# EAGLE schematic kramer-mc (EAGLE 9.5.0)

## Sheet 1 of 5: CPU-Karte
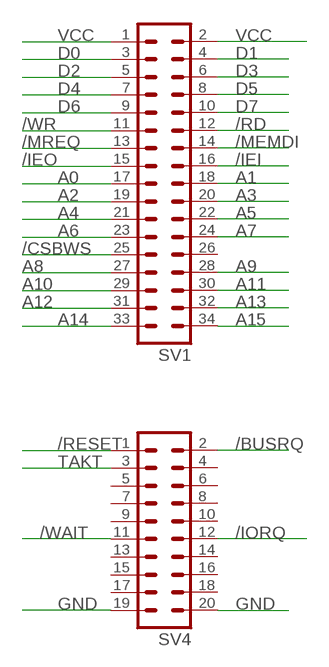
[diagram p0: schematic, sheet 1, part 1 of 2]
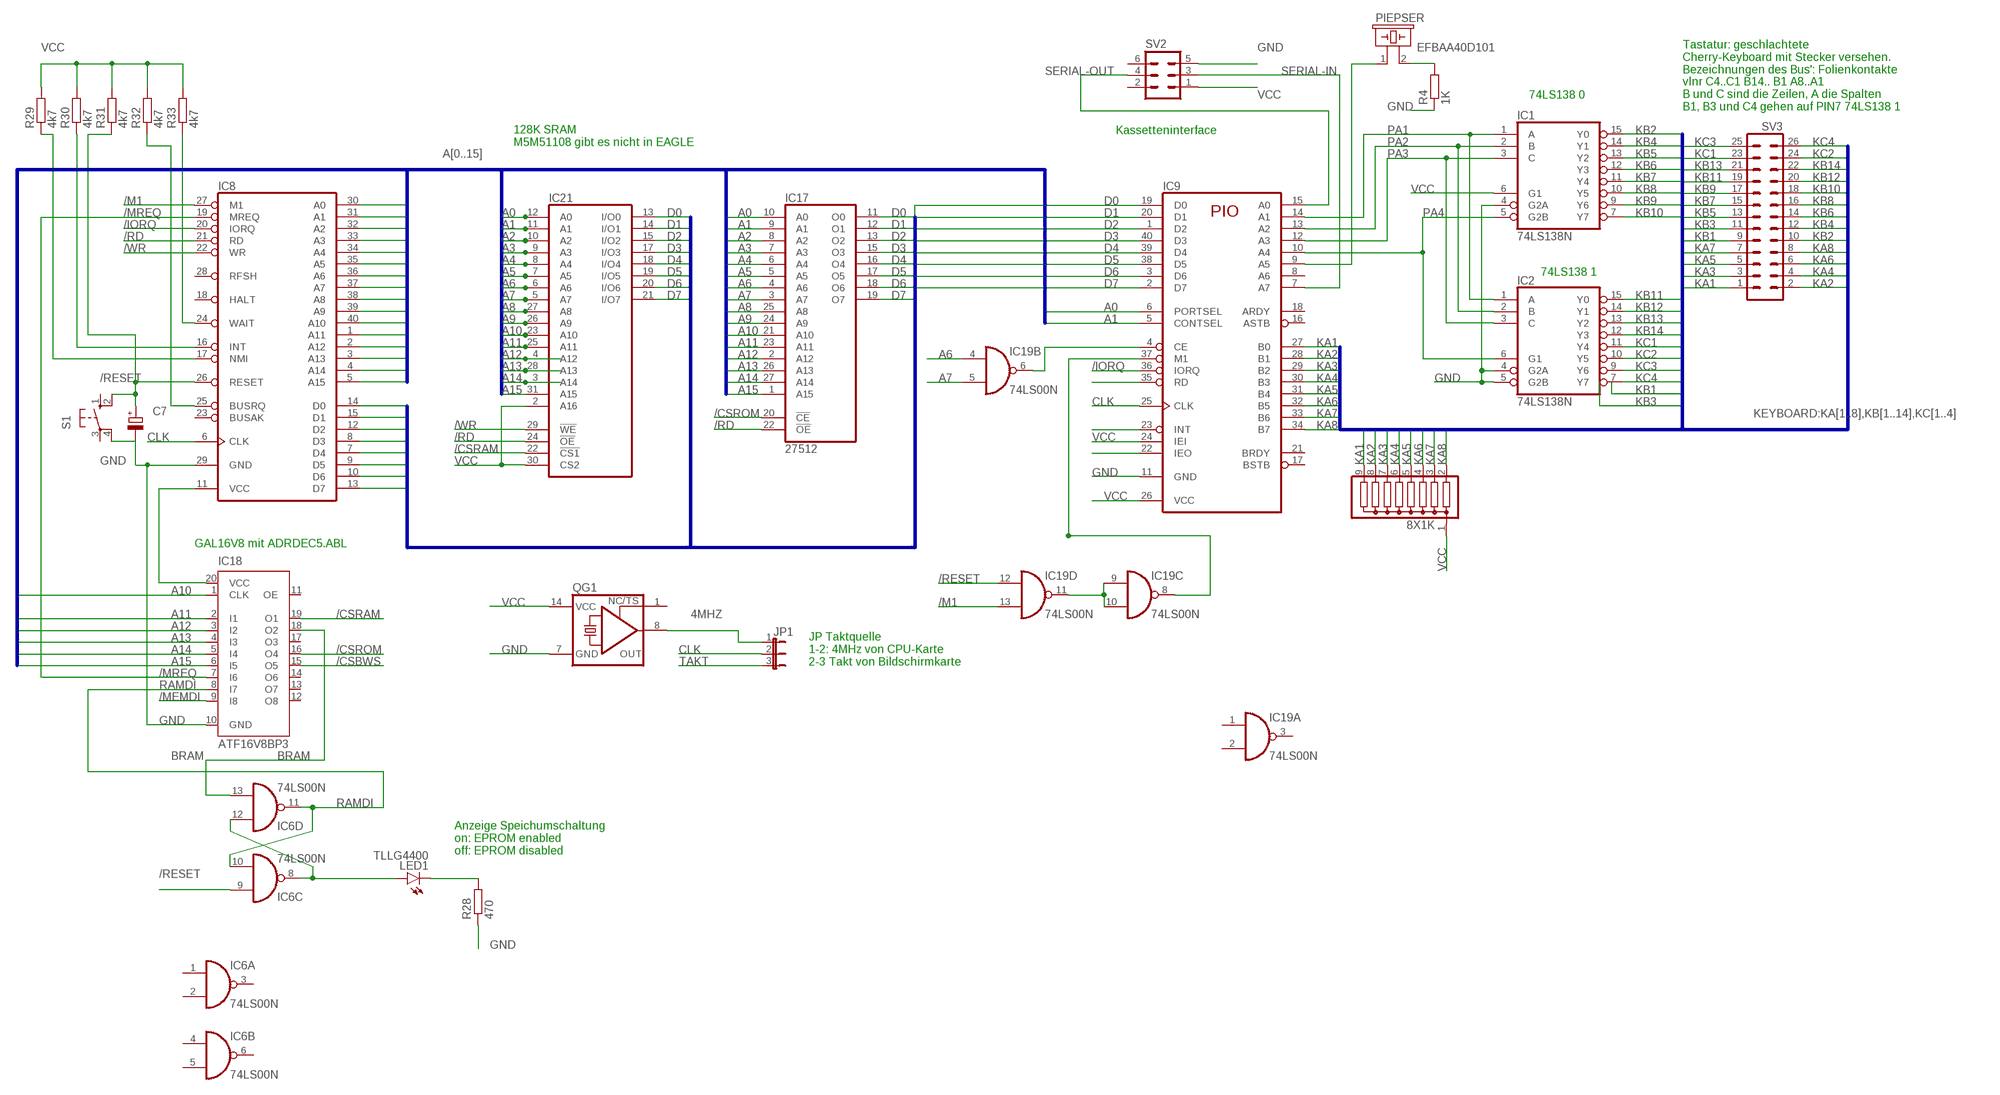
[diagram p1: schematic, sheet 1, part 2 of 2]

### Parts
8X1K  G08R  [SIL9]
C7  CPOL-EUE2-5  [E2-5]
IC1  74LS138N  [DIL16]
IC2  74LS138N  [DIL16]
IC6  74LS00N  [DIL14]
IC8  Z80CPU  [DIL40]
IC9  Z80PIO  [DIL40]
IC17  27512  [DIL28]
IC18  ATF16V8BP3  [DIL20]
IC19  74LS00N  [DIL14]
IC21  LP621024CM  [SOP32L]
JP1  JP2E  [JP2]
LED1  TLLG4400  [LED3MM]
PIEPSER  EFBAA40D101  [EFBAA40D101]
QG1  XO-14  [DIL14S]
R4  1K  R-EU_0207/10  [0207/10]
R28  470  R-EU_0207/10  [0207/10]
R29  4k7  R-EU_0207/10  [0207/10]
R30  4k7  R-EU_0207/10  [0207/10]
R31  4k7  R-EU_0207/10  [0207/10]
R32  4k7  R-EU_0207/10  [0207/10]
R33  4k7  R-EU_0207/10  [0207/10]
S1  10-XX  [B3F-10XX]
SV1  ML34  [ML34]
SV2  ML6  [ML6]
SV3  ML26L  [ML26L]
SV4  ML20  [ML20]

### Nets
4MHZ: JP1.1 QG1.8(OUT)
/BUSRQ: SV4.2 ; also sheet 2,4,5
/CSBWS: IC18.15(O5) SV1.25 ; also sheet 2,4
/CSRAM: IC18.19(O1) IC21.22(!CS1)
/CSROM: IC17.20(!CE) IC18.16(O4)
/IEI: SV1.16 ; also sheet 2,4,5
/IEO: SV1.15 ; also sheet 2,4,5
/IORQ: IC8.20(IORQ) IC9.36(IORQ) SV4.12 ; also sheet 2,4,5
/M1: IC8.27(M1) IC19.13(D:I1) ; also sheet 4,5
/MEMDI: IC18.9(I8) SV1.14 ; also sheet 2,4,5
/MREQ: IC8.19(MREQ) IC18.7(I6) SV1.13 ; also sheet 2,4,5
/RD: IC8.21(RD) IC17.22(!OE) IC21.24(!OE) SV1.12 ; also sheet 2,4,5
/RESET: C7.+ IC6.9(C:I0) IC8.26(RESET) IC19.12(D:I0) R31.1 S1.2(S1) SV4.1 ; also sheet 2,4
/WAIT: SV4.11 ; also sheet 2,4,5
/WR: IC8.22(WR) IC21.29(!WE) SV1.11 ; also sheet 2,4,5
A0: IC8.30(A0) IC9.6(PORTSEL) IC17.10(A0) IC21.12(A0) SV1.17 ; also sheet 2,4,5
A1: IC8.31(A1) IC9.5(CONTSEL) IC17.9(A1) IC21.11(A1) SV1.18 ; also sheet 2,4,5
A2: IC8.32(A2) IC17.8(A2) IC21.10(A2) SV1.19 ; also sheet 2,4,5
A3: IC8.33(A3) IC17.7(A3) IC21.9(A3) SV1.20 ; also sheet 2,4,5
A4: IC8.34(A4) IC17.6(A4) IC21.8(A4) SV1.21 ; also sheet 2,4,5
A5: IC8.35(A5) IC17.5(A5) IC21.7(A5) SV1.22 ; also sheet 2,4,5
A6: IC8.36(A6) IC17.4(A6) IC19.4(B:I0) IC21.6(A6) SV1.23 ; also sheet 2,4,5
A7: IC8.37(A7) IC17.3(A7) IC19.5(B:I1) IC21.5(A7) SV1.24 ; also sheet 2,4,5
A8: IC8.38(A8) IC17.25(A8) IC21.27(A8) SV1.27 ; also sheet 2,4,5
A9: IC8.39(A9) IC17.24(A9) IC21.26(A9) SV1.28 ; also sheet 2,4,5
A10: IC8.40(A10) IC17.21(A10) IC18.1(CLK) IC21.23(A10) SV1.29 ; also sheet 2,4,5
A11: IC8.1(A11) IC17.23(A11) IC18.2(I1) IC21.25(A11) SV1.30 ; also sheet 2,4,5
A12: IC8.2(A12) IC17.2(A12) IC18.3(I2) IC21.4(A12) SV1.31 ; also sheet 2,4,5
A13: IC8.3(A13) IC17.26(A13) IC18.4(I3) IC21.28(A13) SV1.32 ; also sheet 2,4,5
A14: IC8.4(A14) IC17.27(A14) IC18.5(I4) IC21.3(A14) SV1.33 ; also sheet 2,4,5
A15: IC8.5(A15) IC17.1(A15) IC18.6(I5) IC21.31(A15) SV1.34 ; also sheet 2,4,5
BRAM: IC6.13(D:I1) IC18.18(O2)
CLK: IC8.6(CLK) IC9.25(CLK) JP1.2
D0: IC8.14(D0) IC9.19(D0) IC17.11(O0) IC21.13(I/O0) SV1.3 ; also sheet 2,4,5
D1: IC8.15(D1) IC9.20(D1) IC17.12(O1) IC21.14(I/O1) SV1.4 ; also sheet 2,4,5
D2: IC8.12(D2) IC9.1(D2) IC17.13(O2) IC21.15(I/O2) SV1.5 ; also sheet 2,4,5
D3: IC8.8(D3) IC9.40(D3) IC17.15(O3) IC21.17(I/O3) SV1.6 ; also sheet 2,4,5
D4: IC8.7(D4) IC9.39(D4) IC17.16(O4) IC21.18(I/O4) SV1.7 ; also sheet 2,4,5
D5: IC8.9(D5) IC9.38(D5) IC17.17(O5) IC21.19(I/O5) SV1.8 ; also sheet 2,4,5
D6: IC8.10(D6) IC9.3(D6) IC17.18(O6) IC21.20(I/O6) SV1.9 ; also sheet 2,4,5
D7: IC8.13(D7) IC9.2(D7) IC17.19(O7) IC21.21(I/O7) SV1.10 ; also sheet 2,4,5
GND: C7.- IC1.4(G2A) IC2.4(G2A) IC2.5(G2B) IC8.29(GND) IC9.11(GND) IC18.10(GND) QG1.7(GND) R4.1 R28.1 S1.4(P1) SV2.5 SV4.19 SV4.20 ; also sheet 2,3,4,5
KA1: 8X1K.9 IC9.27(B0) SV3.1
KA2: 8X1K.8 IC9.28(B1) SV3.2
KA3: 8X1K.7 IC9.29(B2) SV3.3
KA4: 8X1K.6 IC9.30(B3) SV3.4
KA5: 8X1K.5 IC9.31(B4) SV3.5
KA6: 8X1K.4 IC9.32(B5) SV3.6
KA7: 8X1K.3 IC9.33(B6) SV3.7
KA8: 8X1K.2 IC9.34(B7) SV3.8
KB1: SV3.9
KB2: IC1.15(Y0) SV3.10
KB3: SV3.11
KB4: IC1.14(Y1) SV3.12
KB5: IC1.13(Y2) SV3.13
KB6: IC1.12(Y3) SV3.14
KB7: IC1.11(Y4) SV3.15
KB8: IC1.10(Y5) SV3.16
KB9: IC1.9(Y6) SV3.17
KB10: IC1.7(Y7) SV3.18
KB11: IC2.15(Y0) SV3.19
KB12: IC2.14(Y1) SV3.20
KB13: IC2.13(Y2) SV3.21
KB14: IC2.12(Y3) SV3.22
KC1: IC2.11(Y4) SV3.23
KC2: IC2.10(Y5) SV3.24
KC3: IC2.9(Y6) SV3.25
KC4: IC2.7(Y7) SV3.26
N$13: IC19.9(C:I0) IC19.10(C:I1) IC19.11(D:O)
N$16: IC8.11(VCC) IC18.20(VCC)
N$25: IC6.8(C:O) IC6.12(D:I0) LED1.A
N$27: LED1.K(C) R28.2
N$28: IC9.9(A5) PIEPSER.1
N$29: PIEPSER.2 R4.2
N$35: IC9.4(CE) IC19.6(B:O)
N$36: IC9.37(M1) IC19.8(C:O)
N$38: IC9.35(RD)
N$39: IC9.23(INT)
N$41: IC9.22(IEO)
N$42: IC8.17(NMI) R29.1
N$85: IC8.16(INT) R30.1
N$86: IC8.24(WAIT) R33.1
N$87: IC8.25(BUSRQ) R32.1
PA1: IC1.1(A) IC2.1(A) IC9.14(A1)
PA2: IC1.2(B) IC2.2(B) IC9.13(A2)
PA3: IC1.3(C) IC2.3(C) IC9.12(A3)
PA4: IC1.5(G2B) IC2.6(G1) IC9.10(A4)
RAMDI: IC6.10(C:I1) IC6.11(D:O) IC18.8(I7)
SERIAL-IN: IC9.7(A7) SV2.3
SERIAL-OUT: IC9.15(A0) SV2.4
TAKT: JP1.3 SV4.3 ; also sheet 2,4,5
VCC: 8X1K.1 IC1.6(G1) IC9.24(IEI) IC9.26(VCC) IC21.2(A16) IC21.30(CS2) QG1.14(VCC) R29.2 R30.2 R31.2 R32.2 R33.2 SV1.1 SV1.2 SV2.1 ; also sheet 2,3,4,5
Unconnected: IC6.1(A:I0) IC6.2(A:I1) IC6.3(A:O) IC6.4(B:I0) IC6.5(B:I1) IC6.6(B:O) IC8.18(HALT) IC8.23(BUSAK) IC8.28(RFSH) IC9.8(A6) IC9.16(ASTB) IC9.17(BSTB) IC9.18(ARDY) IC9.21(BRDY) IC18.11(OE) IC18.12(O8) IC18.13(O7) IC18.14(O6) IC18.17(O3) IC19.1(A:I0) IC19.2(A:I1) IC19.3(A:O) IC21.1(NC) QG1.1(TS) S1.1(S) S1.3(P) SV1.26 SV2.2 SV2.6 SV4.4 SV4.5 SV4.6 SV4.7 SV4.8 SV4.9 SV4.10 SV4.13 SV4.14 SV4.15 SV4.16 SV4.17 SV4.18

### Buses
D[0..7]
A[0..15]
KEYBOARD:KA[1..8],KB[1..14],KC[1..4]

### Notes on the sheet
- 74LS138 0
- Tastatur: geschlachtete 
  Cherry-Keyboard mit Stecker versehen.
  Bezeichnungen des Bus': Folienkontakte
  vlnr C4..C1 B14.. B1 A8..A1
  B und C sind die Zeilen, A die Spalten
  B1, B3 und C4 gehen auf PIN7 74LS138 1
- Kassetteninterface
- 128K SRAM
  M5M51108 gibt es nicht in EAGLE
- 74LS138 1
- GAL16V8 mit ADRDEC5.ABL
- JP Taktquelle
  1-2: 4MHz von CPU-Karte
  2-3 Takt von Bildschirmkarte
- Anzeige Speichumschaltung
  on: EPROM enabled
  off: EPROM disabled

## Sheet 2 of 5: Bildschirmkarte
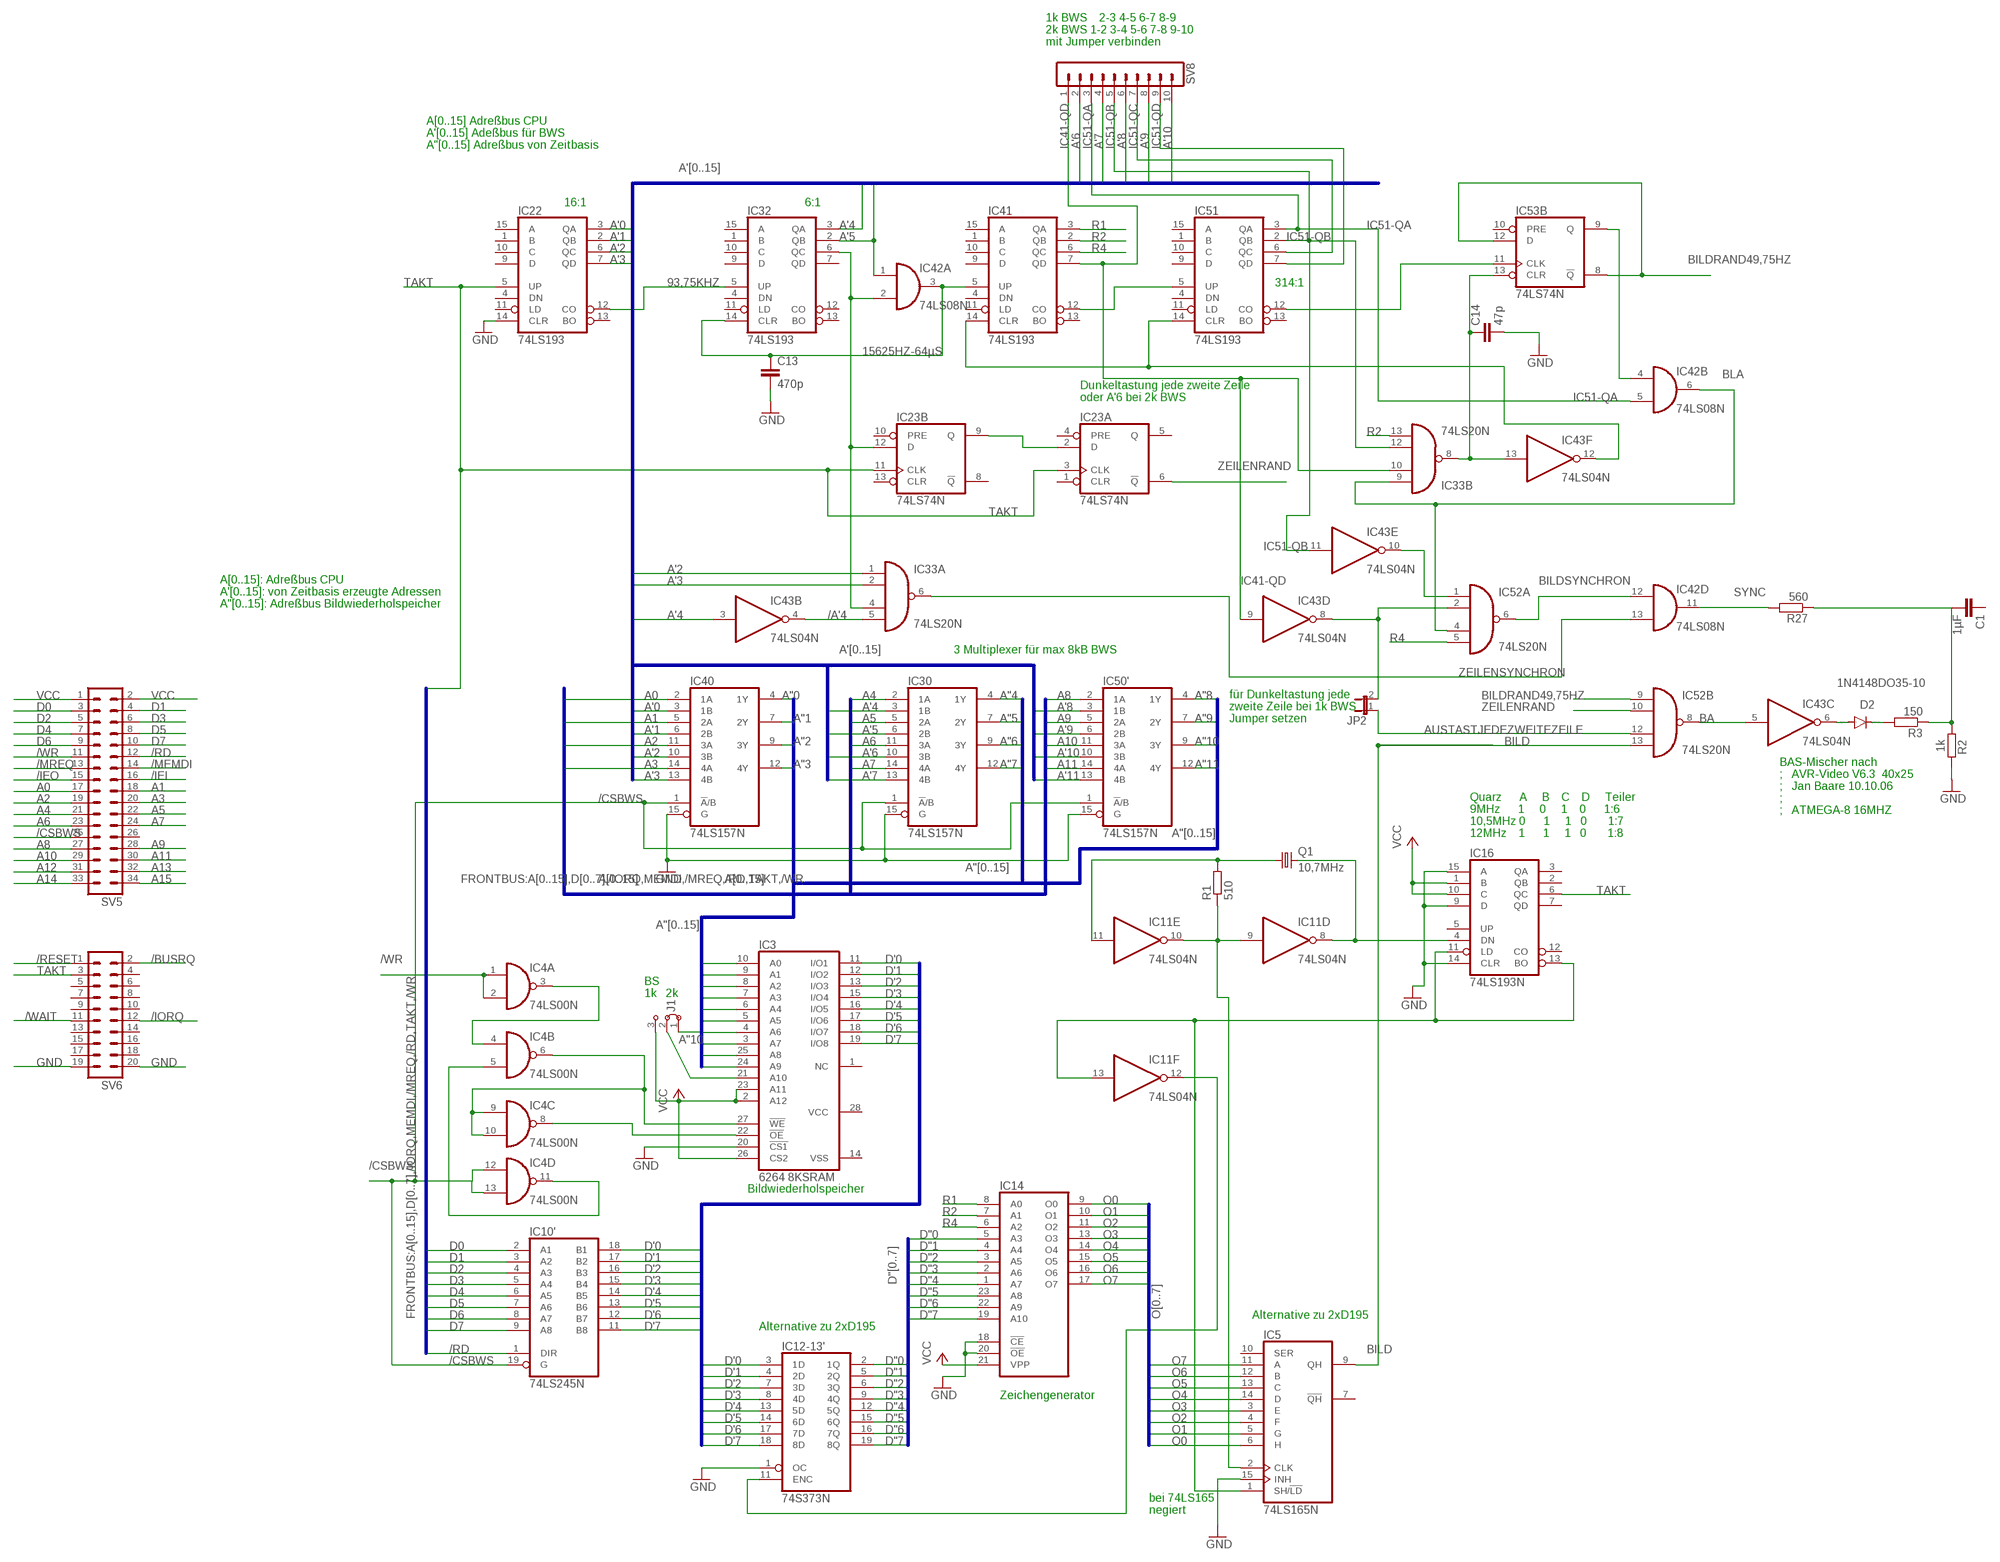
[diagram p2: schematic, sheet 2]

### Parts
C1  1µF  C-EU050-025X075  [C050-025X075]
C13  470p  C-EU050-024X044  [C050-024X044]
C14  47p  C-EU050-024X044  [C050-024X044]
D2  1N4148DO35-10  [DO35-10]
IC3  6264 8KSRAM  6264A  [DIL28-6]
IC4  74LS00N  [DIL14]
IC5  74LS165N  [DIL16]
IC10'  74LS245N  [DIL20]
IC11  74LS04N  [DIL14]
IC12-13'  74S373N  [DIL20]
IC14  2716  [DIL24]
IC16  74LS193N  74LS192N  [DIL16]
IC22  74LS193  74LS192N  [DIL16]
IC23  74LS74N  [DIL14]
IC30  74LS157N  [DIL16]
IC32  74LS193  74LS192N  [DIL16]
IC33  74LS20N  [DIL14]
IC40  74LS157N  [DIL16]
IC41  74LS193  74LS192N  [DIL16]
IC42  74LS08N  [DIL14]
IC43  74LS04N  [DIL14]
IC50'  74LS157N  [DIL16]
IC51  74LS193  74LS192N  [DIL16]
IC52  74LS20N  [DIL14]
IC53  74LS74N  [DIL14]
J1  J2X2MM  [04C]
JP2  JP1E  [JP1]
Q1  10,7MHz  CRYSTALHC49U-V  [HC49U-V]
R1  510  R-EU_0309/12  [0309/12]
R2  1k  R-EU_0309/12  [0309/12]
R3  150  R-EU_0309/12  [0309/12]
R27  560  R-EU_0309/12  [0309/12]
SV5  ML34  [ML34]
SV6  ML20  [ML20]
SV8  MA10-1  [MA10-1]

### Nets
93,75KHZ: IC22.12(CO) IC32.5(UP)
15625HZ-64µS: C13.1 IC32.14(CLR) IC41.5(UP) IC42.3(A:O)
/A'4: IC33.5(A:I3) IC43.4(B:O)
/BUSRQ: SV6.2 ; also sheet 1,4,5
/CSBWS: IC4.12(D:I0) IC4.13(D:I1) IC10'.19(G) IC30.1(!A!/B) IC40.1(!A!/B) IC50'.1(!A!/B) SV5.25 ; also sheet 1,4
/IEI: SV5.16 ; also sheet 1,4,5
/IEO: SV5.15 ; also sheet 1,4,5
/IORQ: SV6.12 ; also sheet 1,4,5
/MEMDI: SV5.14 ; also sheet 1,4,5
/MREQ: SV5.13 ; also sheet 1,4,5
/RD: IC10'.1(DIR) SV5.12 ; also sheet 1,4,5
/RESET: SV6.1 ; also sheet 1,4
/WAIT: SV6.11 ; also sheet 1,4,5
/WR: IC4.1(A:I0) IC4.2(A:I1) SV5.11 ; also sheet 1,4,5
A0: IC40.2(1A) SV5.17 ; also sheet 1,4,5
A1: IC40.5(2A) SV5.18 ; also sheet 1,4,5
A2: IC40.11(3A) SV5.19 ; also sheet 1,4,5
A3: IC40.14(4A) SV5.20 ; also sheet 1,4,5
A4: IC30.2(1A) SV5.21 ; also sheet 1,4,5
A5: IC30.5(2A) SV5.22 ; also sheet 1,4,5
A6: IC30.11(3A) SV5.23 ; also sheet 1,4,5
A7: IC30.14(4A) SV5.24 ; also sheet 1,4,5
A8: IC50'.2(1A) SV5.27 ; also sheet 1,4,5
A9: IC50'.5(2A) SV5.28 ; also sheet 1,4,5
A10: IC50'.11(3A) SV5.29 ; also sheet 1,4,5
A11: IC50'.14(4A) SV5.30 ; also sheet 1,4,5
A12: SV5.31 ; also sheet 1,4,5
A13: SV5.32 ; also sheet 1,4,5
A14: SV5.33 ; also sheet 1,4,5
A15: SV5.34 ; also sheet 1,4,5
A'0: IC22.3(QA) IC40.3(1B)
A'1: IC22.2(QB) IC40.6(2B)
A'2: IC22.6(QC) IC33.1(A:I0) IC40.10(3B)
A'3: IC22.7(QD) IC33.2(A:I1) IC40.13(4B)
A'4: IC30.3(1B) IC32.3(QA) IC43.3(B:I)
A'5: IC30.6(2B) IC32.2(QB) IC42.1(A:I0)
A'6: IC30.10(3B) SV8.2
A'7: IC30.13(4B) SV8.4
A'8: IC50'.3(1B) SV8.6
A'9: IC50'.6(2B) SV8.8
A'10: IC50'.10(3B) SV8.10
A'11: IC50'.13(4B)
A''0: IC3.10(A0) IC40.4(1Y)
A''1: IC3.9(A1) IC40.7(2Y)
A''2: IC3.8(A2) IC40.9(3Y)
A''3: IC3.7(A3) IC40.12(4Y)
A''4: IC3.6(A4) IC30.4(1Y)
A''5: IC3.5(A5) IC30.7(2Y)
A''6: IC3.4(A6) IC30.9(3Y)
A''7: IC3.3(A7) IC30.12(4Y)
A''8: IC3.25(A8) IC50'.4(1Y)
A''9: IC3.24(A9) IC50'.7(2Y)
A''10: IC50'.9(3Y) J1.1
A''11: IC50'.12(4Y)
AUSTASTJEDEZWEITEZEILE: IC52.12(B:I2) JP2.1
BA: IC43.5(C:I) IC52.8(B:O)
BILD: IC5.9(QH) IC52.13(B:I3)
BILDRAND49,75HZ: IC52.9(B:I0) IC53.8(B:!Q) IC53.12(B:D)
BILDSYNCHRON: IC42.12(D:I0) IC52.6(A:O)
BLA: IC33.9(B:I0) IC42.6(B:O) IC52.4(A:I2)
D0: IC10'.2(A1) SV5.3 ; also sheet 1,4,5
D1: IC10'.3(A2) SV5.4 ; also sheet 1,4,5
D2: IC10'.4(A3) SV5.5 ; also sheet 1,4,5
D3: IC10'.5(A4) SV5.6 ; also sheet 1,4,5
D4: IC10'.6(A5) SV5.7 ; also sheet 1,4,5
D5: IC10'.7(A6) SV5.8 ; also sheet 1,4,5
D6: IC10'.8(A7) SV5.9 ; also sheet 1,4,5
D7: IC10'.9(A8) SV5.10 ; also sheet 1,4,5
D'0: IC3.11(I/O1) IC10'.18(B1) IC12-13'.3(1D)
D'1: IC3.12(I/O2) IC10'.17(B2) IC12-13'.4(2D)
D'2: IC3.13(I/O3) IC10'.16(B3) IC12-13'.7(3D)
D'3: IC3.15(I/O4) IC10'.15(B4) IC12-13'.8(4D)
D'4: IC3.16(I/O5) IC10'.14(B5) IC12-13'.13(5D)
D'5: IC3.17(I/O6) IC10'.13(B6) IC12-13'.14(6D)
D'6: IC3.18(I/O7) IC10'.12(B7) IC12-13'.17(7D)
D'7: IC3.19(I/O8) IC10'.11(B8) IC12-13'.18(8D)
D''0: IC12-13'.2(1Q) IC14.5(A3)
D''1: IC12-13'.5(2Q) IC14.4(A4)
D''2: IC12-13'.6(3Q) IC14.3(A5)
D''3: IC12-13'.9(4Q) IC14.2(A6)
D''4: IC12-13'.12(5Q) IC14.1(A7)
D''5: IC12-13'.15(6Q) IC14.23(A8)
D''6: IC12-13'.16(7Q) IC14.22(A9)
D''7: IC12-13'.19(8Q) IC14.19(A10)
GND: C13.2 C14.2 IC3.20(!CS1) IC5.15(INH) IC12-13'.1(OC) IC14.18(!CE) IC14.20(!OE) IC16.9(D) IC16.14(CLR) IC16.15(A) IC22.14(CLR) IC30.15(G) IC40.15(G) IC50'.15(G) R2.2 SV6.19 SV6.20 ; also sheet 1,3,4,5
IC41-QD: IC33.10(B:I1) IC41.7(QD) IC43.9(D:I) SV8.1
IC51-QA: IC42.5(B:I1) IC51.3(QA) SV8.3
IC51-QB: IC33.12(B:I2) IC43.11(E:I) IC51.2(QB) SV8.5
IC51-QC: IC51.6(QC) SV8.7
IC51-QD: IC51.7(QD) SV8.9
N$1: IC43.8(D:O) IC52.2(A:I1) JP2.2
N$2: IC41.12(CO) IC51.5(UP)
N$3: IC23.12(B:D) IC32.6(QC) IC33.4(A:I2) IC42.2(A:I1)
N$4: IC23.2(A:D) IC23.9(B:Q)
N$5: IC41.14(CLR) IC43.12(F:O) IC51.14(CLR)
N$6: IC51.12(CO) IC53.11(B:CLK)
N$7: IC3.21(A10) J1.2
N$8: IC42.4(B:I0) IC53.9(B:Q)
N$9: IC4.3(A:O) IC4.4(B:I0)
N$10: C14.1 IC33.8(B:O) IC43.13(F:I) IC53.13(B:CLR)
N$15: IC43.10(E:O) IC52.1(A:I0)
N$17: IC5.2(CLK) IC11.9(D:I) IC11.10(E:O) R1.1
N$18: IC11.12(F:O) IC12-13'.11(ENC)
N$19: D2.A IC43.6(C:O)
N$20: IC11.8(D:O) IC16.4(DN) Q1.2
N$21: IC11.11(E:I) Q1.1 R1.2
N$22: IC5.1(SH/!LD) IC11.13(F:I) IC16.11(LD) IC16.13(BO)
N$23: D2.C R3.2
N$24: C1.2 R2.1 R3.1 R27.1
N$40: IC4.5(B:I1) IC4.11(D:O)
N$83: IC3.22(!OE) IC4.8(C:O)
N$84: IC3.27(!WE) IC4.6(B:O) IC4.9(C:I0) IC4.10(C:I1)
O0: IC5.6(H) IC14.9(O0)
O1: IC5.5(G) IC14.10(O1)
O2: IC5.4(F) IC14.11(O2)
O3: IC5.3(E) IC14.13(O3)
O4: IC5.14(D) IC14.14(O4)
O5: IC5.13(C) IC14.15(O5)
O6: IC5.12(B) IC14.16(O6)
O7: IC5.11(A) IC14.17(O7)
R1: IC14.8(A0) IC41.3(QA)
R2: IC14.7(A1) IC33.13(B:I3) IC41.2(QB)
R4: IC14.6(A2) IC41.6(QC) IC52.5(A:I3)
SYNC: IC42.11(D:O) R27.2
TAKT: IC16.6(QC) IC22.5(UP) IC23.3(A:CLK) IC23.11(B:CLK) SV6.3 ; also sheet 1,4,5
VCC: IC3.2(A12) IC3.23(A11) IC3.26(CS2) IC14.21(VPP) IC16.1(B) IC16.10(C) J1.3 SV5.1 SV5.2 ; also sheet 1,3,4,5
ZEILENRAND: IC23.6(A:!Q) IC52.10(B:I1)
ZEILENSYNCHRON: IC33.6(A:O) IC42.13(D:I1)
Unconnected: C1.1 IC3.1(NC) IC5.7(!QH) IC5.10(SER) IC11.1(A:I) IC11.2(A:O) IC11.3(B:I) IC11.4(B:O) IC11.5(C:I) IC11.6(C:O) IC16.2(QB) IC16.3(QA) IC16.5(UP) IC16.7(QD) IC16.12(CO) IC22.1(B) IC22.4(DN) IC22.9(D) IC22.10(C) IC22.11(LD) IC22.13(BO) IC22.15(A) IC23.1(A:CLR) IC23.4(A:PRE) IC23.5(A:Q) IC23.8(B:!Q) IC23.10(B:PRE) IC23.13(B:CLR) IC32.1(B) IC32.4(DN) IC32.7(QD) IC32.9(D) IC32.10(C) IC32.11(LD) IC32.12(CO) IC32.13(BO) IC32.15(A) IC41.1(B) IC41.4(DN) IC41.9(D) IC41.10(C) IC41.11(LD) IC41.13(BO) IC41.15(A) IC42.8(C:O) IC42.9(C:I0) IC42.10(C:I1) IC43.1(A:I) IC43.2(A:O) IC51.1(B) IC51.4(DN) IC51.9(D) IC51.10(C) IC51.11(LD) IC51.13(BO) IC51.15(A) IC53.1(A:CLR) IC53.2(A:D) IC53.3(A:CLK) IC53.4(A:PRE) IC53.5(A:Q) IC53.6(A:!Q) IC53.10(B:PRE) SV5.26 SV6.4 SV6.5 SV6.6 SV6.7 SV6.8 SV6.9 SV6.10 SV6.13 SV6.14 SV6.15 SV6.16 SV6.17 SV6.18

### Buses
A[0..15]
A'[0..15]
D'[0..7]
O[0..7]
FRONTBUS:A[0..15],D[0..7],/IORQ,MEMDI,/MREQ,/RD,TAKT,/WR
A''[0..15]
D''[0..7]

### Notes on the sheet
- 1k BWS    2-3 4-5 6-7 8-9
  2k BWS 1-2 3-4 5-6 7-8 9-10
  mit Jumper verbinden
- A[0..15] Adreßbus CPU
  A'[0..15] Adeßbus für BWS
  A''[0..15] Adreßbus von Zeitbasis
- 16:1 | 6:1
- 314:1
- Dunkeltastung jede zweite Zeile
  oder A'6 bei 2k BWS
- A[0..15]: Adreßbus CPU
  A'[0..15]: von Zeitbasis erzeugte Adressen
  A''[0..15]: Adreßbus Bildwiederholspeicher
- 3 Multiplexer für max 8kB BWS
- für Dunkeltastung jede
  zweite Zeile bei 1k BWS 
  Jumper setzen
- BAS-Mischer nach
  ;   AVR-Video V6.3  40x25
  ;   Jan Baare 10.10.06
  ;
  ;   ATMEGA-8 16MHZ
- Quarz      A     B    C    D     Teiler
  9MHz      1     0     1    0      1:6
  10,5MHz 0      1     1   0       1:7
  12MHz    1      1     1   0       1:8
- BS
  1k   2k
- Bildwiederholspeicher
- Alternative zu 2xD195
- Alternative zu 2xD195
- Zeichengenerator
- bei 74LS165 
  negiert

## Sheet 3 of 5: Kassetteninterface
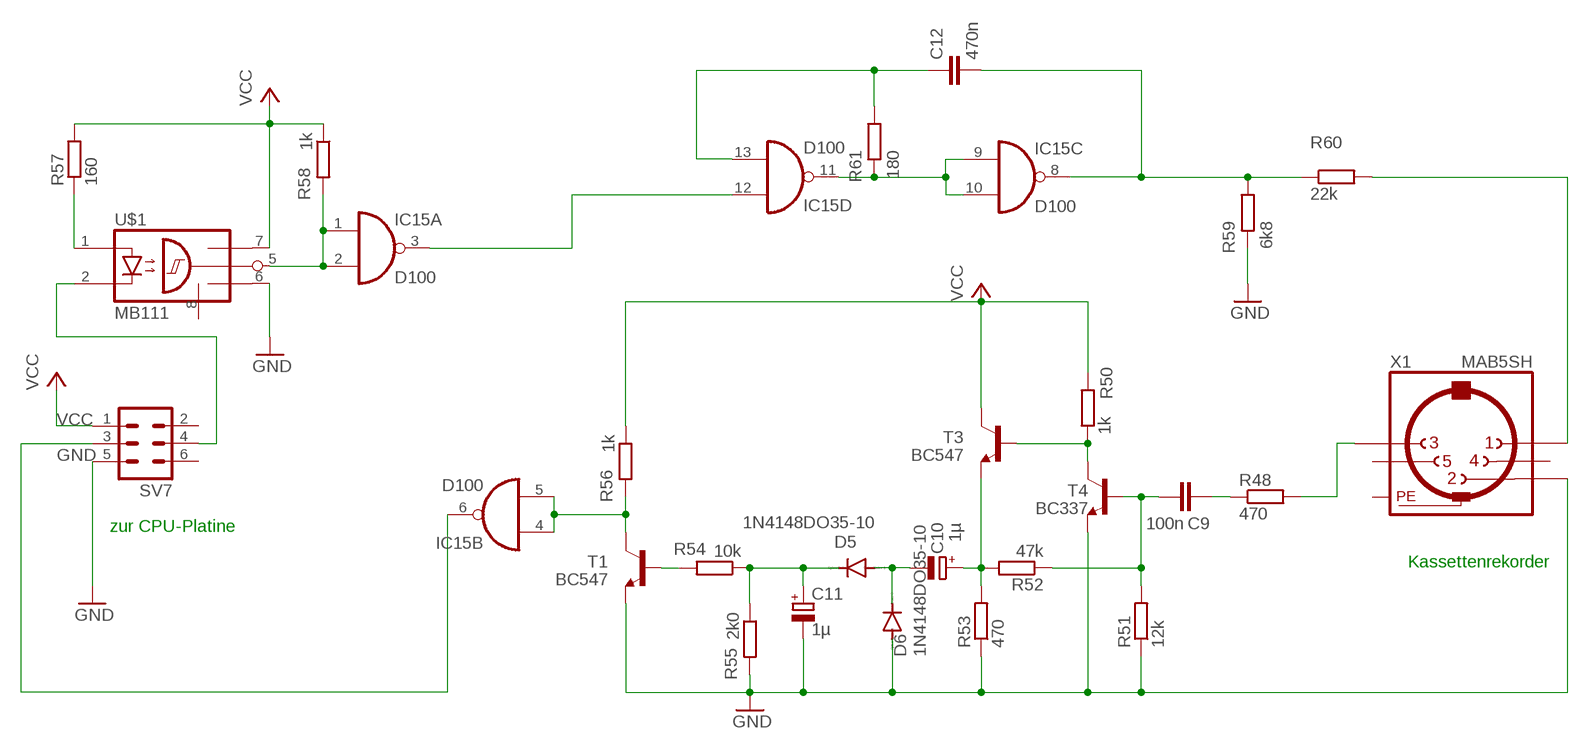
[diagram p3: schematic, sheet 3]

### Parts
C9  100n  C-EU025-025X050  [C025-025X050]
C10  1µ  CPOL-EUE2,5-6E  [E2,5-6E]
C11  1µ  CPOL-EUE2,5-6E  [E2,5-6E]
C12  470n  C-EU150-064X183  [C150-064X183]
D5  1N4148DO35-10  [DO35-10]
D6  1N4148DO35-10  [DO35-10]
IC15  D100  7400N  [DIL14]
R48  470  R-EU_0207/10  [0207/10]
R50  1k  R-EU_0207/10  [0207/10]
R51  12k  R-EU_0207/10  [0207/10]
R52  47k  R-EU_0207/10  [0207/10]
R53  470  R-EU_0207/10  [0207/10]
R54  10k  R-EU_0207/10  [0207/10]
R55  2k0  R-EU_0207/10  [0207/10]
R56  1k  R-EU_0207/10  [0207/10]
R57  160  R-EU_0207/10  [0207/10]
R58  1k  R-EU_0207/10  [0207/10]
R59  6k8  R-EU_0207/10  [0207/10]
R60  22k  R-EU_0207/10  [0207/10]
R61  180  R-EU_0207/10  [0207/10]
SV7  ML6  [ML6]
T1  BC547  [TO92]
T3  BC547  [TO92]
T4  BC337  [TO92]
U$1  MB111  [DIL8]
X1  MAB5SH  [MAB5SH]

### Nets
GND: C11.- D6.A R51.1 R53.1 R55.2 R59.2 SV7.5 T1.1(E) T4.1(E) U$1.6(GND1) X1.2 ; also sheet 1,2,4,5
N$88: IC15.6(B:O) SV7.3
N$89: SV7.4 U$1.2(C)
N$108: R48.2 X1.3
N$109: C9.1 R48.1
N$119: C9.2 R51.2 R52.1 T4.2(B)
N$120: R50.1 T3.2(B) T4.3(C)
N$121: R57.1 U$1.1(A)
N$122: C10.+ R52.2 R53.2 T3.1(E)
N$123: IC15.1(A:I0) IC15.2(A:I1) R58.2 U$1.5(OUT1)
N$124: C10.- D5.A D6.C
N$125: C11.+ D5.C R54.1 R55.1
N$126: R60.2 X1.1
N$127: R54.2 T1.2(B)
N$128: IC15.4(B:I0) IC15.5(B:I1) R56.2 T1.3(C)
N$129: IC15.9(C:I0) IC15.10(C:I1) IC15.11(D:O) R61.2
N$130: C12.1 IC15.13(D:I1) R61.1
N$131: C12.2 IC15.8(C:O) R59.1 R60.1
N$132: IC15.3(A:O) IC15.12(D:I0)
VCC: R50.2 R56.1 R57.2 R58.1 SV7.1 T3.3(C) U$1.7(VCC1) ; also sheet 1,2,4,5
Unconnected: SV7.2 SV7.6 U$1.8(KATHODE_EMPF) X1.4 X1.5

### Notes on the sheet
- zur CPU-Platine
- Kassettenrekorder

## Sheet 4 of 5: FDC-Karte
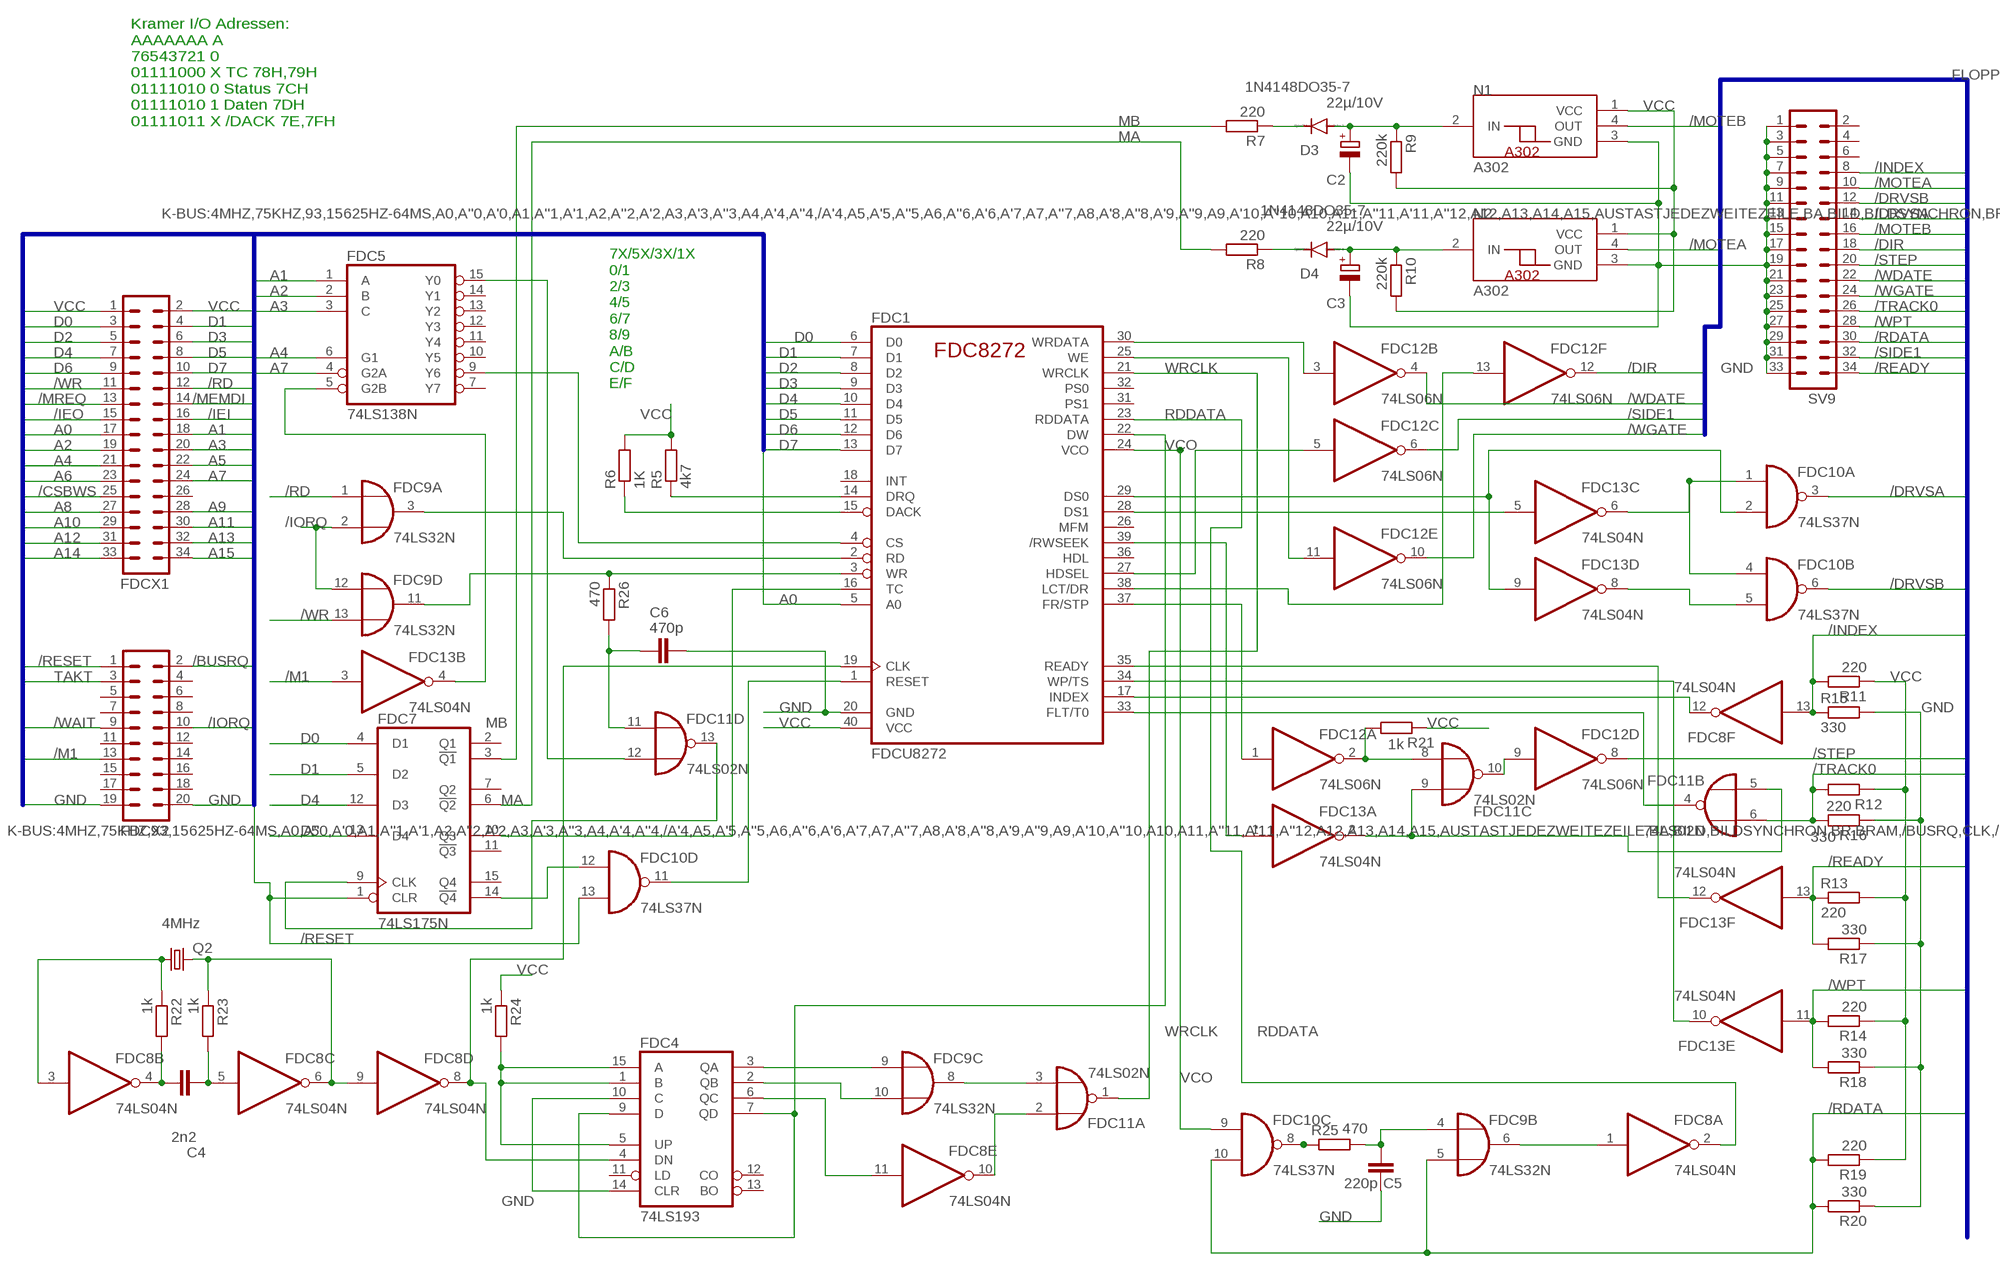
[diagram p4: schematic, sheet 4, part 1 of 2]
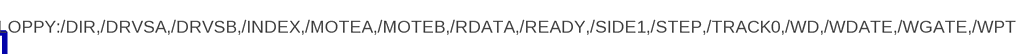
[diagram p5: schematic, sheet 4, part 2 of 2]

### Parts
C2  22µ/10V  CPOL-EUE2.5-5  [E2,5-5]
C3  22µ/10V  CPOL-EUE2.5-5  [E2,5-5]
C4  2n2  C-EU025-025X050  [C025-025X050]
C5  220p  C-EU025-025X050  [C025-025X050]
C6  470p  C-EU025-025X050  [C025-025X050]
D3  1N4148DO35-7  [DO35-7]
D4  1N4148DO35-7  [DO35-7]
FDC1  FDCU8272  [DIL40]
FDC4  74LS193  74HC192N  [DIL16]
FDC5  74LS138N  [DIL16]
FDC7  74LS175N  [DIL16]
FDC8  74LS04N  [DIL14]
FDC9  74LS32N  [DIL14]
FDC10  74LS37N  [DIL14]
FDC11  74LS02N  [DIL14]
FDC12  74LS06N  [DIL14]
FDC13  74LS04N  [DIL14]
FDCX1  ML34  [ML34]
FDCX2  ML20  [ML20]
N1  A302  [DIL04]
N2  A302  [DIL04]
Q2  4MHz  CRYSTALHC49U-V  [HC49U-V]
R5  4k7  R-EU_0207/10  [0207/10]
R6  1K  R-EU_0207/10  [0207/10]
R7  220  R-EU_0207/10  [0207/10]
R8  220  R-EU_0207/10  [0207/10]
R9  220k  R-EU_0207/10  [0207/10]
R10  220k  R-EU_0207/10  [0207/10]
R11  220  R-EU_0207/10  [0207/10]
R12  220  R-EU_0207/10  [0207/10]
R13  220  R-EU_0207/10  [0207/10]
R14  220  R-EU_0207/10  [0207/10]
R15  330  R-EU_0207/10  [0207/10]
R16  330  R-EU_0207/10  [0207/10]
R17  330  R-EU_0207/10  [0207/10]
R18  330  R-EU_0207/10  [0207/10]
R19  220  R-EU_0207/10  [0207/10]
R20  330  R-EU_0207/10  [0207/10]
R21  1k  R-EU_0207/10  [0207/10]
R22  1k  R-EU_0207/10  [0207/10]
R23  1k  R-EU_0207/10  [0207/10]
R24  1k  R-EU_0207/10  [0207/10]
R25  470  R-EU_0207/10  [0207/10]
R26  470  R-EU_0207/10  [0207/10]
SV9  ML34  [ML34]

### Nets
/BUSRQ: FDCX2.2 ; also sheet 1,2,5
/CSBWS: FDCX1.25 ; also sheet 1,2
/DIR: FDC12.12(F:O) SV9.18
/DRVSA: FDC10.3(A:O) SV9.14
/DRVSB: FDC10.6(B:O) SV9.12
/IEI: FDCX1.16 ; also sheet 1,2,5
/IEO: FDCX1.15 ; also sheet 1,2,5
/INDEX: FDC8.13(F:I) R11.2 R15.1 SV9.8
/IORQ: FDC9.2(A:I1) FDC9.12(D:I0) FDCX2.10 ; also sheet 1,2,5
/M1: FDC13.3(B:I) FDCX2.13 ; also sheet 1,5
/MEMDI: FDCX1.14 ; also sheet 1,2,5
/MOTEA: N2.4(OUT) SV9.10
/MOTEB: N1.4(OUT) SV9.16
/MREQ: FDCX1.13 ; also sheet 1,2,5
/RD: FDC9.1(A:I0) FDCX1.12 ; also sheet 1,2,5
/RDATA: FDC9.5(B:I1) FDC10.10(C:I1) R19.2 R20.2 SV9.30
/READY: FDC13.13(F:I) R13.1 R17.2 SV9.34
/RESET: FDC7.1(CLR) FDC10.13(D:I1) FDCX2.1 ; also sheet 1,2
/SIDE1: FDC12.6(C:O) SV9.32
/STEP: FDC12.8(D:O) SV9.20
/TRACK0: FDC11.6(B:I1) R12.2 R16.2 SV9.26
/WAIT: FDCX2.9 ; also sheet 1,2,5
/WDATE: FDC12.4(B:O) SV9.22
/WGATE: FDC12.10(E:O) SV9.24
/WPT: FDC13.11(E:I) R14.2 R18.2 SV9.28
/WR: FDC9.13(D:I1) FDCX1.11 ; also sheet 1,2,5
A0: FDC1.5(A0) FDCX1.17 ; also sheet 1,2,5
A1: FDC5.1(A) FDCX1.18 ; also sheet 1,2,5
A2: FDC5.2(B) FDCX1.19 ; also sheet 1,2,5
A3: FDC5.3(C) FDCX1.20 ; also sheet 1,2,5
A4: FDC5.6(G1) FDCX1.21 ; also sheet 1,2,5
A5: FDCX1.22 ; also sheet 1,2,5
A6: FDCX1.23 ; also sheet 1,2,5
A7: FDC5.4(G2A) FDCX1.24 ; also sheet 1,2,5
A8: FDCX1.27 ; also sheet 1,2,5
A9: FDCX1.28 ; also sheet 1,2,5
A10: FDCX1.29 ; also sheet 1,2,5
A11: FDCX1.30 ; also sheet 1,2,5
A12: FDCX1.31 ; also sheet 1,2,5
A13: FDCX1.32 ; also sheet 1,2,5
A14: FDCX1.33 ; also sheet 1,2,5
A15: FDCX1.34 ; also sheet 1,2,5
D0: FDC1.6(D0) FDC7.4(D1) FDCX1.3 ; also sheet 1,2,5
D1: FDC1.7(D1) FDC7.5(D2) FDCX1.4 ; also sheet 1,2,5
D2: FDC1.8(D2) FDCX1.5 ; also sheet 1,2,5
D3: FDC1.9(D3) FDCX1.6 ; also sheet 1,2,5
D4: FDC1.10(D4) FDC7.12(D3) FDCX1.7 ; also sheet 1,2,5
D5: FDC1.11(D5) FDC7.13(D4) FDCX1.8 ; also sheet 1,2,5
D6: FDC1.12(D6) FDCX1.9 ; also sheet 1,2,5
D7: FDC1.13(D7) FDCX1.10 ; also sheet 1,2,5
GND: C2.- C3.- C5.1 C6.2 FDC1.20(GND) FDC4.10(C) FDC4.14(CLR) FDCX2.19 FDCX2.20 N1.3(GND) N2.3(GND) R15.2 R16.1 R17.1 R18.1 R20.1 SV9.1 SV9.3 SV9.5 SV9.7 SV9.9 SV9.11 SV9.13 SV9.15 SV9.17 SV9.19 SV9.21 SV9.23 SV9.25 SV9.27 SV9.29 SV9.31 SV9.33 ; also sheet 1,2,3,5
MA: FDC7.6(!Q2) R8.2
MB: FDC7.3(!Q1) R7.2
N$14: FDC1.14(DRQ) R5.1
N$26: FDC1.2(RD) FDC9.3(A:O)
N$30: FDC1.15(DACK) R6.1
N$31: FDC7.14(!Q4) FDC10.12(D:I0)
N$32: FDC1.29(DS0) FDC10.2(A:I1) FDC13.9(D:I)
N$33: FDC1.28(DS1) FDC13.5(C:I)
N$34: FDC10.1(A:I0) FDC10.4(B:I0) FDC13.6(C:O)
N$37: FDC10.5(B:I1) FDC13.8(D:O)
N$43: D3.C R7.1
N$44: C2.+ D3.A N1.2(IN) R9.1
N$45: C3.+ D4.A N2.2(IN) R10.1
N$46: D4.C R8.1
N$47: FDC1.17(INDEX) FDC8.12(F:O)
N$48: FDC1.33(FLT/T0) FDC11.4(B:O)
N$49: FDC1.35(READY) FDC13.12(F:O)
N$50: FDC1.34(WP/TS) FDC13.10(E:O)
N$51: FDC11.10(C:O) FDC12.9(D:I)
N$52: FDC11.8(C:I0) FDC12.2(A:O) R21.2
N$53: FDC11.5(B:I0) FDC11.9(C:I1) FDC13.2(A:O)
N$54: C4.1 FDC8.4(B:O) R22.2
N$55: FDC8.3(B:I) Q2.1 R22.1
N$56: FDC8.6(C:O) FDC8.9(D:I) Q2.2 R23.1
N$57: C4.2 FDC8.5(C:I) R23.2
N$58: FDC1.19(CLK) FDC4.4(DN) FDC8.8(D:O)
N$59: FDC4.1(B) FDC4.5(UP) FDC4.15(A) R24.2
N$60: FDC1.22(DW) FDC4.7(QD) FDC4.9(D)
N$61: FDC4.3(QA) FDC9.9(C:I0)
N$62: FDC4.2(QB) FDC9.10(C:I1)
N$63: FDC4.6(QC) FDC8.11(E:I)
N$64: FDC9.8(C:O) FDC11.3(A:I1)
N$65: FDC8.10(E:O) FDC11.2(A:I0)
N$66: FDC8.1(A:I) FDC9.6(B:O)
N$67: FDC10.8(C:O) R25.1
N$68: C5.2 FDC9.4(B:I0) R25.2
N$69: FDC1.39(/RWSEEK) FDC13.1(A:I)
N$70: FDC1.37(FR/STP) FDC12.1(A:I)
N$71: FDC1.30(WRDATA) FDC12.3(B:I)
N$72: FDC1.27(HDSEL) FDC12.5(C:I)
N$73: FDC1.25(WE) FDC12.11(E:I)
N$74: FDC1.38(LCT/DR) FDC12.13(F:I)
N$75: FDC1.3(WR) FDC9.11(D:O) R26.1
N$76: FDC1.1(RESET) FDC10.11(D:O)
N$77: FDC1.16(TC) FDC7.10(Q3)
N$78: FDC7.9(CLK) FDC11.13(D:O)
N$79: C6.1 FDC11.11(D:I0) R26.2
N$80: FDC5.5(G2B) FDC13.4(B:O)
N$81: FDC1.4(CS) FDC5.9(Y6)
N$82: FDC5.15(Y0) FDC11.12(D:I1)
RDDATA: FDC1.23(RDDATA) FDC8.2(A:O)
TAKT: FDCX2.3 ; also sheet 1,2,5
VCC: FDC1.40(VCC) FDCX1.1 FDCX1.2 N1.1(VCC) N2.1(VCC) R5.2 R6.2 R9.2 R10.2 R11.1 R12.1 R13.2 R14.1 R19.1 R21.1 R24.1 ; also sheet 1,2,3,5
VCO: FDC1.24(VCO) FDC10.9(C:I0)
WRCLK: FDC1.21(WRCLK) FDC11.1(A:O)
Unconnected: FDC1.18(INT) FDC1.26(MFM) FDC1.31(PS1) FDC1.32(PS0) FDC1.36(HDL) FDC4.11(LD) FDC4.12(CO) FDC4.13(BO) FDC5.7(Y7) FDC5.10(Y5) FDC5.11(Y4) FDC5.12(Y3) FDC5.13(Y2) FDC5.14(Y1) FDC7.2(Q1) FDC7.7(Q2) FDC7.11(!Q3) FDC7.15(Q4) FDCX1.26 FDCX2.4 FDCX2.5 FDCX2.6 FDCX2.7 FDCX2.8 FDCX2.11 FDCX2.12 FDCX2.14 FDCX2.15 FDCX2.16 FDCX2.17 FDCX2.18 SV9.2 SV9.4 SV9.6

### Buses
FLOPPY:/DIR,/DRVSA,/DRVSB,/INDEX,/MOTEA,/MOTEB,/RDATA,/READY,/SIDE1,/STEP,/TRACK0,/WD,/WDATE,/WGATE,/WPT
K-BUS:4MHZ,75KHZ,93,15625HZ-64ΜS,A0,A''0,A'0,A1,A''1,A'1,A2,A''2,A'2,A3,A'3,A''3,A4,A'4,A''4,/A'4,A5,A'5,A''5,A6,A''6,A'6,A'7,A7,A''7,A8,A'8,A''8,A'9,A''9,A9,A'10,A''10,A10,A11,A''11,A'11,A''12,A12,A13,A14,A15,AUSTASTJEDEZWEITEZEILE,BA,BILD,BILDSYNCHRON,BR,BRAM,/BUSRQ,CLK,/CSBWS,/CSBWS1,/CSRAM,/CSROM,D0,D'0,D1,D'1,D2,D'2,D3,D'3,D4,D'4,D5,D'5,D6,D'6,D'7,D7,/DIR,/DRVSA,/DRVSB,GND,IC41-QD,/IEI,/IEO,/INDEX,/IORQ,KA1,KA2,KA3,KA4,KA5,KA6,KA7,KA8,KB1,KB2,KB3,KB4,KB5,KB6,KB7,KB8,KB9,KB10,KB11,KB12,KB13,KB14,KC1,KC2,KC3,KC4,/M1,MA,MB,/MEMDI,/MOTEA,/MOTEB,/MREQ,/MREQ1,N$2,N$3,N$4,N$5,N$6,N$8,N$9,N$10,N$12,N$13,N$14,N$15,N$16,N$17,N$18,N$19,N$20,N$21,N$22,N$23,N$24,N$25,N$26,N$27,N$28,N$29,N$30,N$31,N$32,N$33,N$34,N$35,N$36,N$37,N$38,N$39,N$40,N$41,N$42,N$43,N$44,N$45,N$46,N$47,N$48,N$49,N$50,N$51,N$52,N$53,N$54,N$55,N$56,N$57,N$58,N$59,N$60,N$61,N$62,N$63,N$64,N$65,N$66,N$67,N$68,N$69,N$70,N$71,N$72,N$73,N$74,N$75,N$76,N$77,N$78,N$79,N$80,N$81,N$82,N$83,N$84,N$85,N$86,N$87,N$88,N$89,N$90,N$91,N$92,N$93,N$94,N$95,N$96,N$97,N$98,N$99,N$100,N$102,O0,O1,O2,O3,O4,O5,O6,O7,PA1,PA2,PA3,PA4,R1,R2,R4,RAMDI,/RD,/RDATA,RDDATA,/READY,/RESET,/RESET1,SERIAL-IN,SERIAL-OUT,/SIDE1,/STEP,SYNC,TAKT,/TRACK0,VCC,VCO,/WAIT,/WDATE,/WGATE,/WPT,/WR,WRCLK,ZEILENRAND,ZEILENSYNCHRON

### Notes on the sheet
- Kramer I/O Adressen:
  AAAAAAA A
  76543721 0
  01111000 X TC 78H,79H
  01111010 0 Status 7CH
  01111010 1 Daten 7DH
  01111011 X /DACK 7E,7FH
- 7X/5X/3X/1X
  0/1
  2/3
  4/5
  6/7
  8/9
  A/B
  C/D
  E/F

## Sheet 5 of 5: Einzelschrittsteuerung
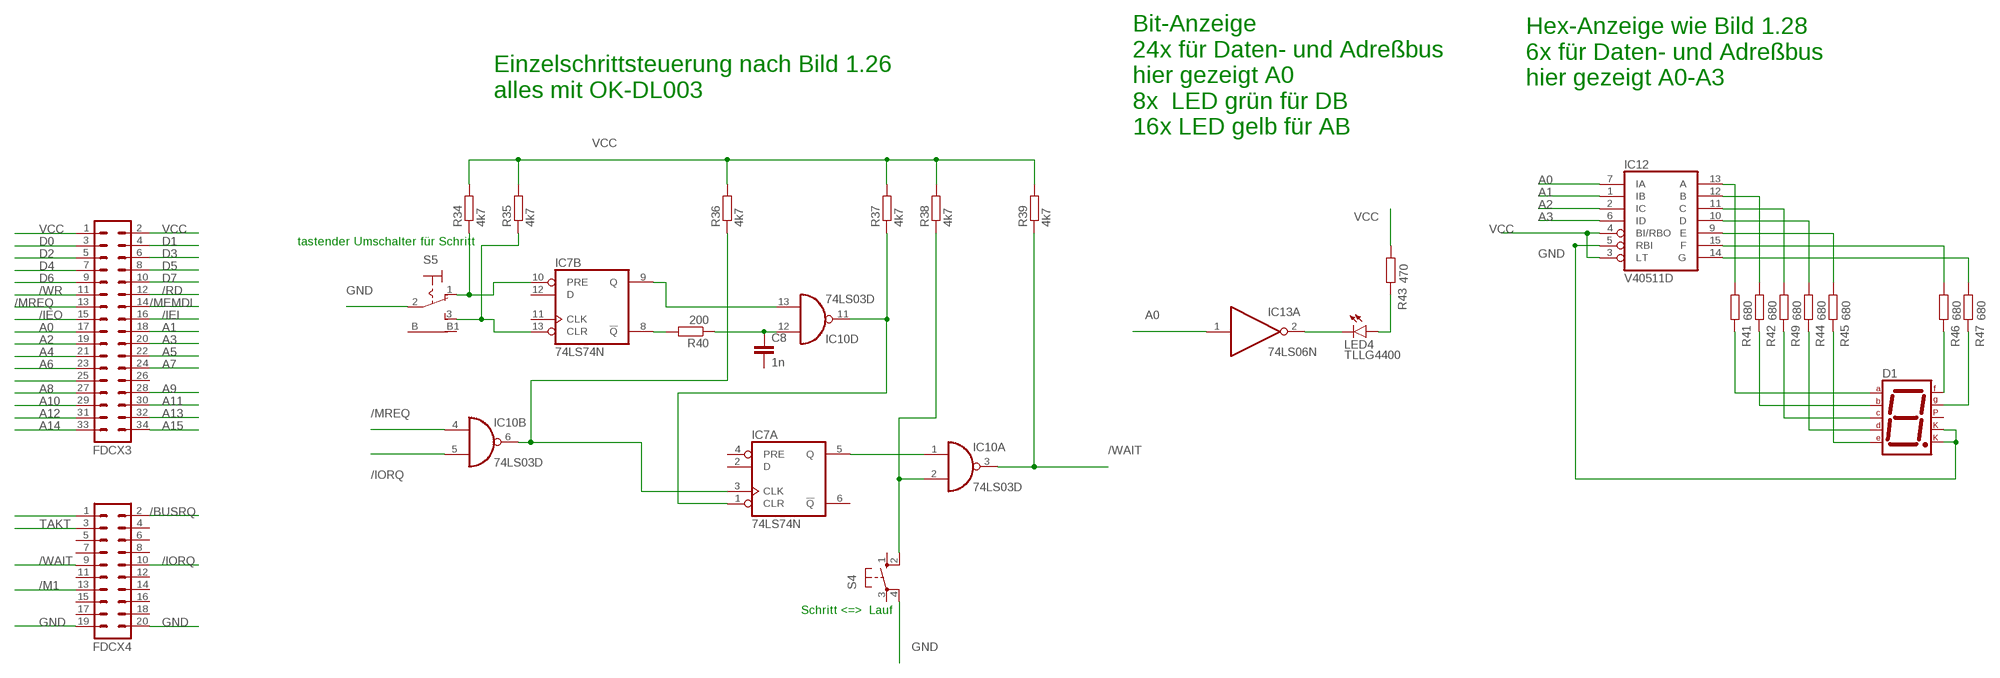
[diagram p6: schematic, sheet 5]

### Parts
C8  1n  C-EU050-024X044  [C050-024X044]
D1  7SEG-CK  [7SEG-13]
FDCX3  ML34  [ML34]
FDCX4  ML20  [ML20]
IC7  74LS74N  [DIL14]
IC10  74LS03D  [SO14]
IC12  V40511D  74LS47N  [DIL16]
IC13  74LS06N  [DIL14]
LED4  TLLG4400  [LED3MM]
R34  4k7  R-EU_0309/12  [0309/12]
R35  4k7  R-EU_0309/12  [0309/12]
R36  4k7  R-EU_0309/12  [0309/12]
R37  4k7  R-EU_0309/12  [0309/12]
R38  4k7  R-EU_0309/12  [0309/12]
R39  4k7  R-EU_0309/12  [0309/12]
R40  200  R-EU_0309/12  [0309/12]
R41  680  R-EU_0309/12  [0309/12]
R42  680  R-EU_0309/12  [0309/12]
R43  470  R-EU_0309/12  [0309/12]
R44  680  R-EU_0309/12  [0309/12]
R45  680  R-EU_0309/12  [0309/12]
R46  680  R-EU_0309/12  [0309/12]
R47  680  R-EU_0309/12  [0309/12]
R49  680  R-EU_0309/12  [0309/12]
S4  10-XX  [B3F-10XX]
S5  316-917  [316-917]

### Nets
/BUSRQ: FDCX4.2 ; also sheet 1,2,4
/CSBWS1: FDCX3.25
/IEI: FDCX3.16 ; also sheet 1,2,4
/IEO: FDCX3.15 ; also sheet 1,2,4
/IORQ: FDCX4.10 IC10.5(B:I1) ; also sheet 1,2,4
/M1: FDCX4.13 ; also sheet 1,4
/MEMDI: FDCX3.14 ; also sheet 1,2,4
/MREQ: FDCX3.13 IC10.4(B:I0) ; also sheet 1,2,4
/RD: FDCX3.12 ; also sheet 1,2,4
/RESET1: FDCX4.1
/WAIT: FDCX4.9 IC10.3(A:O) R39.1 ; also sheet 1,2,4
/WR: FDCX3.11 ; also sheet 1,2,4
A0: FDCX3.17 IC12.7(IA) IC13.1(A:I) ; also sheet 1,2,4
A1: FDCX3.18 IC12.1(IB) ; also sheet 1,2,4
A2: FDCX3.19 IC12.2(IC) ; also sheet 1,2,4
A3: FDCX3.20 IC12.6(ID) ; also sheet 1,2,4
A4: FDCX3.21 ; also sheet 1,2,4
A5: FDCX3.22 ; also sheet 1,2,4
A6: FDCX3.23 ; also sheet 1,2,4
A7: FDCX3.24 ; also sheet 1,2,4
A8: FDCX3.27 ; also sheet 1,2,4
A9: FDCX3.28 ; also sheet 1,2,4
A10: FDCX3.29 ; also sheet 1,2,4
A11: FDCX3.30 ; also sheet 1,2,4
A12: FDCX3.31 ; also sheet 1,2,4
A13: FDCX3.32 ; also sheet 1,2,4
A14: FDCX3.33 ; also sheet 1,2,4
A15: FDCX3.34 ; also sheet 1,2,4
D0: FDCX3.3 ; also sheet 1,2,4
D1: FDCX3.4 ; also sheet 1,2,4
D2: FDCX3.5 ; also sheet 1,2,4
D3: FDCX3.6 ; also sheet 1,2,4
D4: FDCX3.7 ; also sheet 1,2,4
D5: FDCX3.8 ; also sheet 1,2,4
D6: FDCX3.9 ; also sheet 1,2,4
D7: FDCX3.10 ; also sheet 1,2,4
GND: D1.3(CK1) D1.8(CK2) FDCX4.19 FDCX4.20 IC12.5(RBI) S4.4(P1) S5.2(P) ; also sheet 1,2,3,4
N$92: IC7.10(B:PRE) R34.1 S5.1(O)
N$93: IC7.13(B:CLR) R35.1 S5.3(S)
N$94: IC7.9(B:Q) IC10.13(D:I1)
N$95: IC12.13(A) R41.1
N$96: IC7.8(B:!Q) R40.2
N$97: C8.1 IC10.12(D:I0) R40.1
N$98: IC7.1(A:CLR) IC10.11(D:O) R37.1
N$99: IC10.2(A:I1) R38.1 S4.2(S1)
N$100: IC7.5(A:Q) IC10.1(A:I0)
N$101: IC12.12(B) R42.1
N$102: IC7.3(A:CLK) IC10.6(B:O) R36.1
N$103: IC12.11(C) R49.1
N$104: IC12.10(D) R44.1
N$105: IC12.9(E) R45.1
N$106: IC13.2(A:O) LED4.K(C)
N$107: LED4.A R43.2
N$110: IC12.15(F) R46.1
N$111: IC12.14(G) R47.1
N$112: D1.7(A) R41.2
N$113: D1.6(B) R42.2
N$114: D1.10(G) R47.2
N$115: D1.9(F) R46.2
N$116: D1.4(C) R49.2
N$117: D1.2(D) R44.2
N$118: D1.1(E) R45.2
TAKT: FDCX4.3 ; also sheet 1,2,4
VCC: FDCX3.1 FDCX3.2 IC12.3(LT) IC12.4(BI/RBO) R34.2 R35.2 R36.2 R37.2 R38.2 R39.2 R43.1 ; also sheet 1,2,3,4
Unconnected: C8.2 D1.5(DP) FDCX3.26 FDCX4.4 FDCX4.5 FDCX4.6 FDCX4.7 FDCX4.8 FDCX4.11 FDCX4.12 FDCX4.14 FDCX4.15 FDCX4.16 FDCX4.17 FDCX4.18 IC7.2(A:D) IC7.4(A:PRE) IC7.6(A:!Q) IC7.11(B:CLK) IC7.12(B:D) IC10.8(C:O) IC10.9(C:I0) IC10.10(C:I1) IC13.3(B:I) IC13.4(B:O) IC13.5(C:I) IC13.6(C:O) IC13.8(D:O) IC13.9(D:I) IC13.10(E:O) IC13.11(E:I) IC13.12(F:O) IC13.13(F:I) S4.1(S) S4.3(P) S5.B S5.B1

### Notes on the sheet
- Hex-Anzeige wie Bild 1.28
  6x für Daten- und Adreßbus
  hier gezeigt A0-A3
- Einzelschrittsteuerung nach Bild 1.26
  alles mit OK-DL003
- Bit-Anzeige
  24x für Daten- und Adreßbus
  hier gezeigt A0
  8x  LED grün für DB
  16x LED gelb für AB
- tastender Umschalter für Schritt
- Schritt <=>  Lauf

## Power pins joined to a net without a drawn wire
GND: FDC4.8(GND) FDC5.8(GND) FDC7.8(GND) FDC8.7(P:GND) FDC9.7(P:GND) FDC10.7(P:GND) FDC11.7(P:GND) FDC12.7(P:GND) FDC13.7(P:GND) IC1.8(GND) IC2.8(GND) IC4.7(P:GND) IC5.8(GND) IC6.7(P:GND) IC7.7(P:GND) IC10'.10(GND) IC10.7(P:GND) IC11.7(P:GND) IC12-13'.10(GND) IC12.8(GND) IC13.7(P:GND) IC14.12(GND) IC15.7(P:GND) IC16.8(GND) IC17.14(GND) IC19.7(P:GND) IC21.16(GND) IC22.8(GND) IC23.7(P:GND) IC30.8(GND) IC32.8(GND) IC33.7(P:GND) IC40.8(GND) IC41.8(GND) IC42.7(P:GND) IC43.7(P:GND) IC50'.8(GND) IC51.8(GND) IC52.7(P:GND) IC53.7(P:GND)
PE: X1.PE X1.PE@(PE)
VCC: FDC4.16(VCC) FDC5.16(VCC) FDC7.16(VCC) FDC8.14(P:VCC) FDC9.14(P:VCC) FDC10.14(P:VCC) FDC11.14(P:VCC) FDC12.14(P:VCC) FDC13.14(P:VCC) IC1.16(VCC) IC2.16(VCC) IC3.28(VCC) IC4.14(P:VCC) IC5.16(VCC) IC6.14(P:VCC) IC7.14(P:VCC) IC10'.20(VCC) IC10.14(P:VCC) IC11.14(P:VCC) IC12-13'.20(VCC) IC12.16(VCC) IC13.14(P:VCC) IC14.24(VCC) IC15.14(P:VCC) IC16.16(VCC) IC17.28(VCC) IC19.14(P:VCC) IC21.32(VCC) IC22.16(VCC) IC23.14(P:VCC) IC30.16(VCC) IC32.16(VCC) IC33.14(P:VCC) IC40.16(VCC) IC41.16(VCC) IC42.14(P:VCC) IC43.14(P:VCC) IC50'.16(VCC) IC51.16(VCC) IC52.14(P:VCC) IC53.14(P:VCC)
VSS: IC3.14(VSS)

## Library data of the parts
8X1K = resistor-sil:G08R: SIL RESISTOR; OC_FARNELL: unknown; OC_NEWARK: unknown
C1 C4-C6 C8 C9 C12-C14 = rcl:C-EU: CAPACITOR, European symbol; SPICEPREFIX: C
C2 C3 C7 C10 C11 = rcl:CPOL-EU: POLARIZED CAPACITOR, European symbol; SPICEPREFIX: C
D1 = special:7SEG-CK: 7-segment DISPLAY single cathode, 13 mm
D2-D6 = diode:1N4148: DIODE high speed (Philips)
FDC1 = zilogbodo:FDCU8272
FDC4 IC16 IC22 IC32 IC41 IC51 = 74xx-eu:74*192: Synchronous 4-bit UP/DOWN COUNTER
FDC5 IC1 IC2 = 74xx-eu:74*138: 3-line to 8-line DECODER/DEMULTIPLEXER
FDC7 = 74xx-eu:74*175: Qadruple D type FLIP FLOP, clear
FDC8 FDC13 IC11 IC43 = 74xx-eu:74*04: Hex INVERTER
FDC9 = 74xx-eu:74*32: Quad 2-input OR gate
FDC10 = 74xx-eu:74*37: Quad 2-input NAND buffer
FDC11 = 74xx-eu:74*02: Quad 2-input NOR gate
FDC12 IC13 = 74xx-eu:74*06: Hex INVERTER, open collector high-voltage output
FDCX1 FDCX3 SV1 SV5 SV9 = con-harting-ml:ML34: HARTING; OC_FARNELL: unknown; OC_NEWARK: unknown
FDCX2 FDCX4 SV4 SV6 = con-harting-ml:ML20: HARTING; OC_FARNELL: unknown; OC_NEWARK: unknown
IC3 = memory-hitachi:6264A: MEMORY; OC_FARNELL: 283605; OC_NEWARK: unknown
IC4 IC6 IC15 IC19 = 74xx-eu:74*00: Quad 2-input NAND gate
IC5 = 74xx-eu:74*165: 8-bit parallel load SHIFT REGISTER
IC7 IC23 IC53 = 74xx-eu:74*74: Dual D type positive edge triggered FLIP FLOP, preset and clear
IC8 = zilog:Z80CPU: Z80 FAMILY DEVICE
IC9 = zilog:Z80PIO: Z80 FAMILY DEVICE
IC10 = 74xx-eu:74*03: Quad 2-input NAND gate, open collector output
IC10' = 74xx-eu:74*245: Octal BUS TRANSCEIVER, 3-state
IC12 = 74xx-eu:74*47: BCD to seven segment DECODER/DRIVER Source: http://www.ee.washington.edu/stores/DataSheets/74ls/74ls47.pdf
IC12-13' = 74xx-eu:74*373: Octal D type transparent LATCH, edge triggered
IC14 = memory:2716: MEMORY
IC17 = memory:27512: MEMORY
IC18 = atmel:ATF16V8B: High perfomance CMOS (electrically erasable) programmable logic device (PLD) ABLE-Atmel-ABEL - P18V8R, P16V8C, P16V8AS, P17V8 COPL Atmel-WinCUPL - G16V8MS, G16V8MA, G16V8AS, G16V8 LOG/IC - GAL16V8_R, GAL16V8_G7, GAL16V8_C), GAL16V8 Tango-PLD - G16V8R, G16V8C, G16V8AS, G16V8 Source: http://www.atmel.com/dyn/resources/prod_documents/DOC0364.PDF; MPN: ATF16V8CZ-15PU; OC_FARNELL: 1551768; OC_NEWARK: 94M6254
IC21 = memory:LP621024CM: MEMORY
IC30 IC40 IC50' = 74xx-eu:74*157: Quadruple 2-line to 1-line data SELECTOR/MULTIPLEXER
IC33 IC52 = 74xx-eu:74*20: Dual 4-input NAND gate
IC42 = 74xx-eu:74*08: Quad 2-input AND gate
J1 = jumper:J2: Jumper switch 2 x 2.5 mm
JP1 = jumper:JP2E: JUMPER
JP2 = jumper:JP1E: JUMPER
LED1 LED4 = led:TLLG4400: Low Current (2mA) LED 3 mm Tinted Diffused Package color GREEN Source: Data sheet <http://www.farnell.com/datasheets/391098.pdf>; MF: VISHAY SEMICONDUCTOR; OC_FARNELL: 1612435
N1 N2 = bodos-lbr:A302
PIEPSER = buzzer:EFB?: Piezoelectric Acoustic Transducer Source: Panbasonic .. 2SC1685.pdf; OC_FARNELL: unknown; OC_NEWARK: unknown
Q1 Q2 = crystal:CRYSTAL: CRYSTAL; OC_FARNELL: 1666969; OC_NEWARK: unknown
QG1 = crystal:XO-: CRYSTAL; OC_FARNELL: unknown; OC_NEWARK: unknown
R1-R61 = rcl:R-EU_: RESISTOR, European symbol; SPICEPREFIX: R
S1 S4 = switch-omron:10-XX: OMRON SWITCH; MPN: B3F-1000; OC_FARNELL: 176432; OC_NEWARK: 36M3542
S5 = switch:316-917: TOGGLE SWITCH Mors, distributor RS Components
SV2 SV7 = con-harting-ml:ML6: HARTING; OC_FARNELL: unknown; OC_NEWARK: unknown
SV3 = con-harting-ml:ML26: HARTING; OC_FARNELL: unknown; OC_NEWARK: unknown
SV8 = con-lstb:MA10-1: PIN HEADER; OC_FARNELL: unknown; OC_NEWARK: unknown
T1 T3 = transistor:BC547: NPN TRANSISTOR
T4 = transistor:BC337: NPN TRANSISTOR
U$1 = bodos-bauelemente:MB111: OPTOKOPPLER mit OK Ausgang
X1 = con-hirschmann:MAB5SH: Female CONNECTOR 5 pins 90 deg. with shield, horizontal (DIN 41524); OC_FARNELL: 809883; OC_NEWARK: unknown